# EAGLE design MicroPrimePCB (EAGLE 7.2.0)
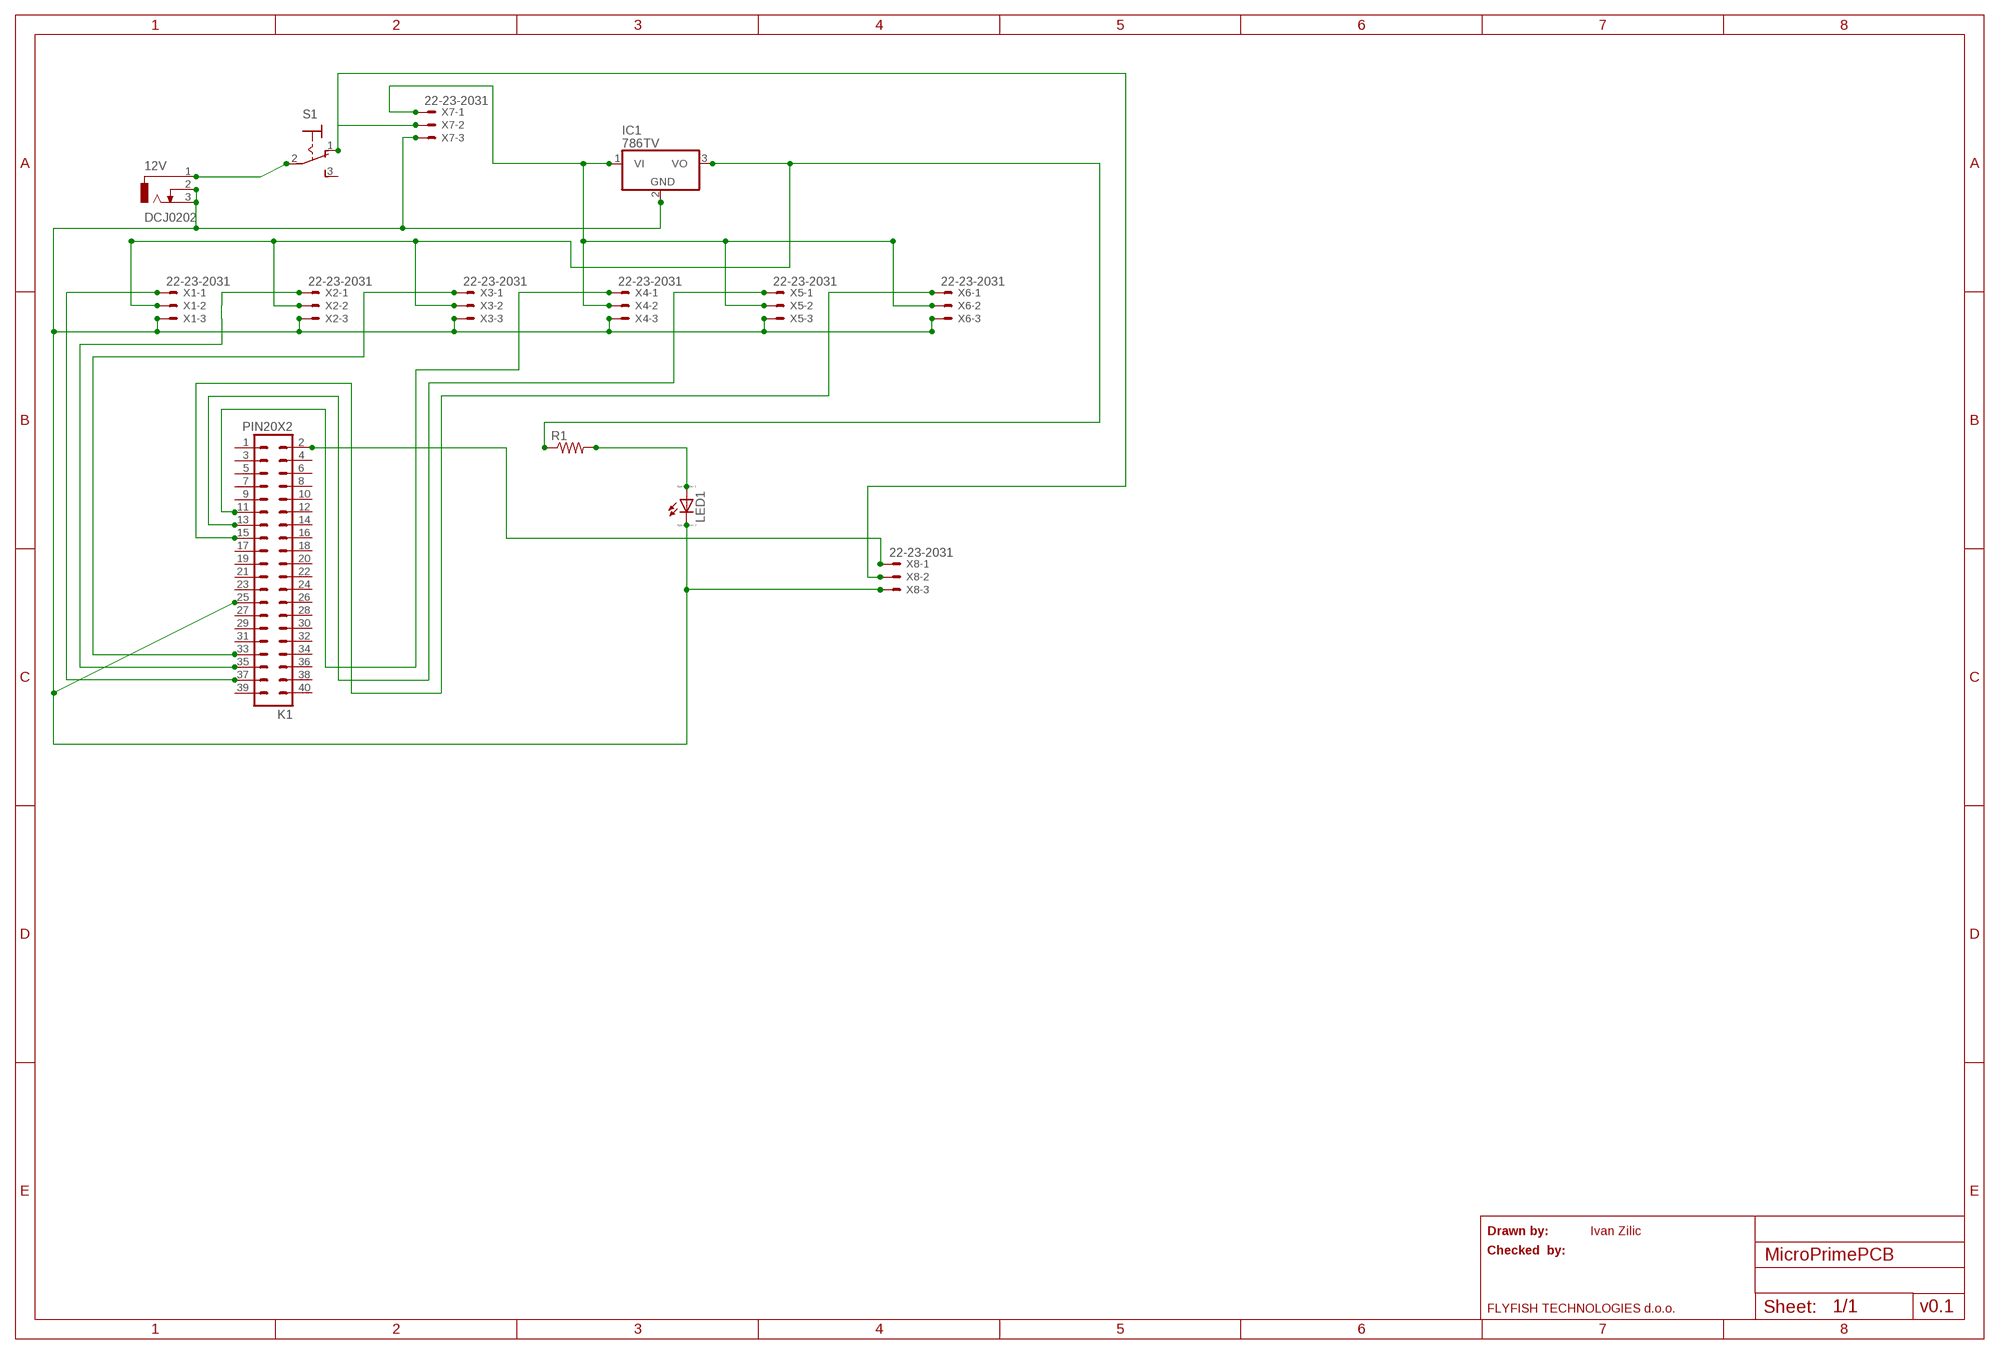
[diagram p0: schematic, sheet 1]

## Parts
12V  DCJ0202  [DCJ0202]
IC1  786TV  [TO220V]
K1  PIN20X2  [PIN_20X2]
LED1  LED_ELD260  [LED_LD260]
R1  R-US_0204/7  [0204/7]
S1  320-916  [320-916]
X1  22-23-2031  [22-23-2031]
X2  22-23-2031  [22-23-2031]
X3  22-23-2031  [22-23-2031]
X4  22-23-2031  [22-23-2031]
X5  22-23-2031  [22-23-2031]
X6  22-23-2031  [22-23-2031]
X7  22-23-2031  [22-23-2031]
X8  22-23-2031  [22-23-2031]

## Nets
N$1: 12V.1 S1.2(P)
N$4: IC1.1(VI) X4.2 X5.2 X6.2 X7.1
N$5: 12V.2 12V.3 IC1.2(GND) K1.25 LED1.K(C) X1.3 X2.3 X3.3 X4.3 X5.3 X6.3 X7.3 X8.3
N$6: K1.2 X8.1
N$7: S1.1(O) X7.2 X8.2
N$9: LED1.A R1.2
N$11: K1.37 X1.1
N$12: K1.35 X2.1
N$14: K1.33 X3.1
N$15: IC1.3(VO) R1.1 X1.2 X2.2 X3.2
N$16: K1.11 X4.1
N$18: K1.13 X5.1
N$20: K1.15 X6.1
Unconnected: K1.1 K1.3 K1.4 K1.5 K1.6 K1.7 K1.8 K1.9 K1.10 K1.12 K1.14 K1.16 K1.17 K1.18 K1.19 K1.20 K1.21 K1.22 K1.23 K1.24 K1.26 K1.27 K1.28 K1.29 K1.30 K1.31 K1.32 K1.34 K1.36 K1.38 K1.39 K1.40 S1.3(S)

## Notes on the sheet
- Drawn by: | Ivan Zilic
- Checked  by:
- FLYFISH TECHNOLOGIES d.o.o. | v0.1

## Library data of the parts
12V = con-jack:DCJ0202: DC POWER JACK Source: DCJ0202.pdf; OC_FARNELL: unknown; OC_NEWARK: unknown
IC1 = linear:78*: Positive VOLTAGE REGULATOR Source: http://cache.national.com/ds/LM/LM78L05.pdf http://www.fairchildsemi.com/ds/LM/LM7805.pdf
K1 = FLYFISH:PIN20X2
LED1 = eagle-ltspice:LED_E: LED Source: http://www.osram.convergy.de Source: www.luxeon.com Source: www.kingbright.com; SPICEMODEL: NONE; SPICEPREFIX: D; SPICETYPE: diode
R1 = resistor:R-US_: RESISTOR, American symbol
S1 = switch:320-916: TOGGLE SWITCH distributor RS Components
X1-X8 = con-molex:22-23-2031: .100" (2.54mm) Center Header - 3 Pin; MF: MOLEX; MPN: 22-23-2031; OC_FARNELL: 1462950; OC_NEWARK: 30C0862

## Net classes
0 default: clearance 0.205 mm

## Board
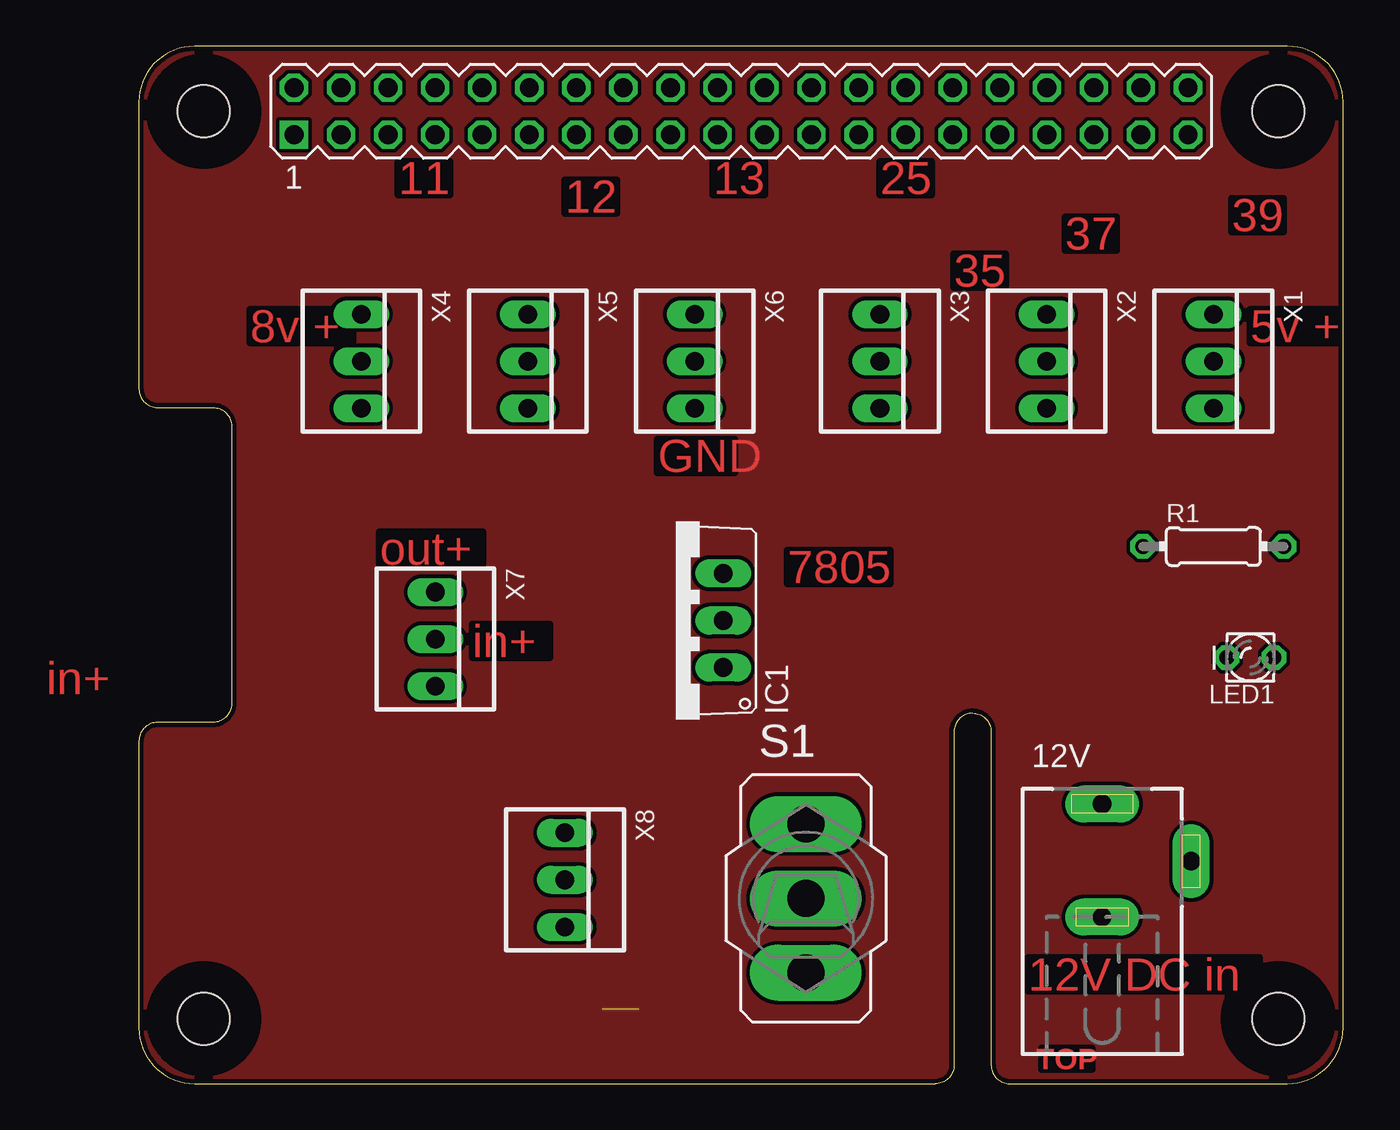
[diagram p1: board, top side]
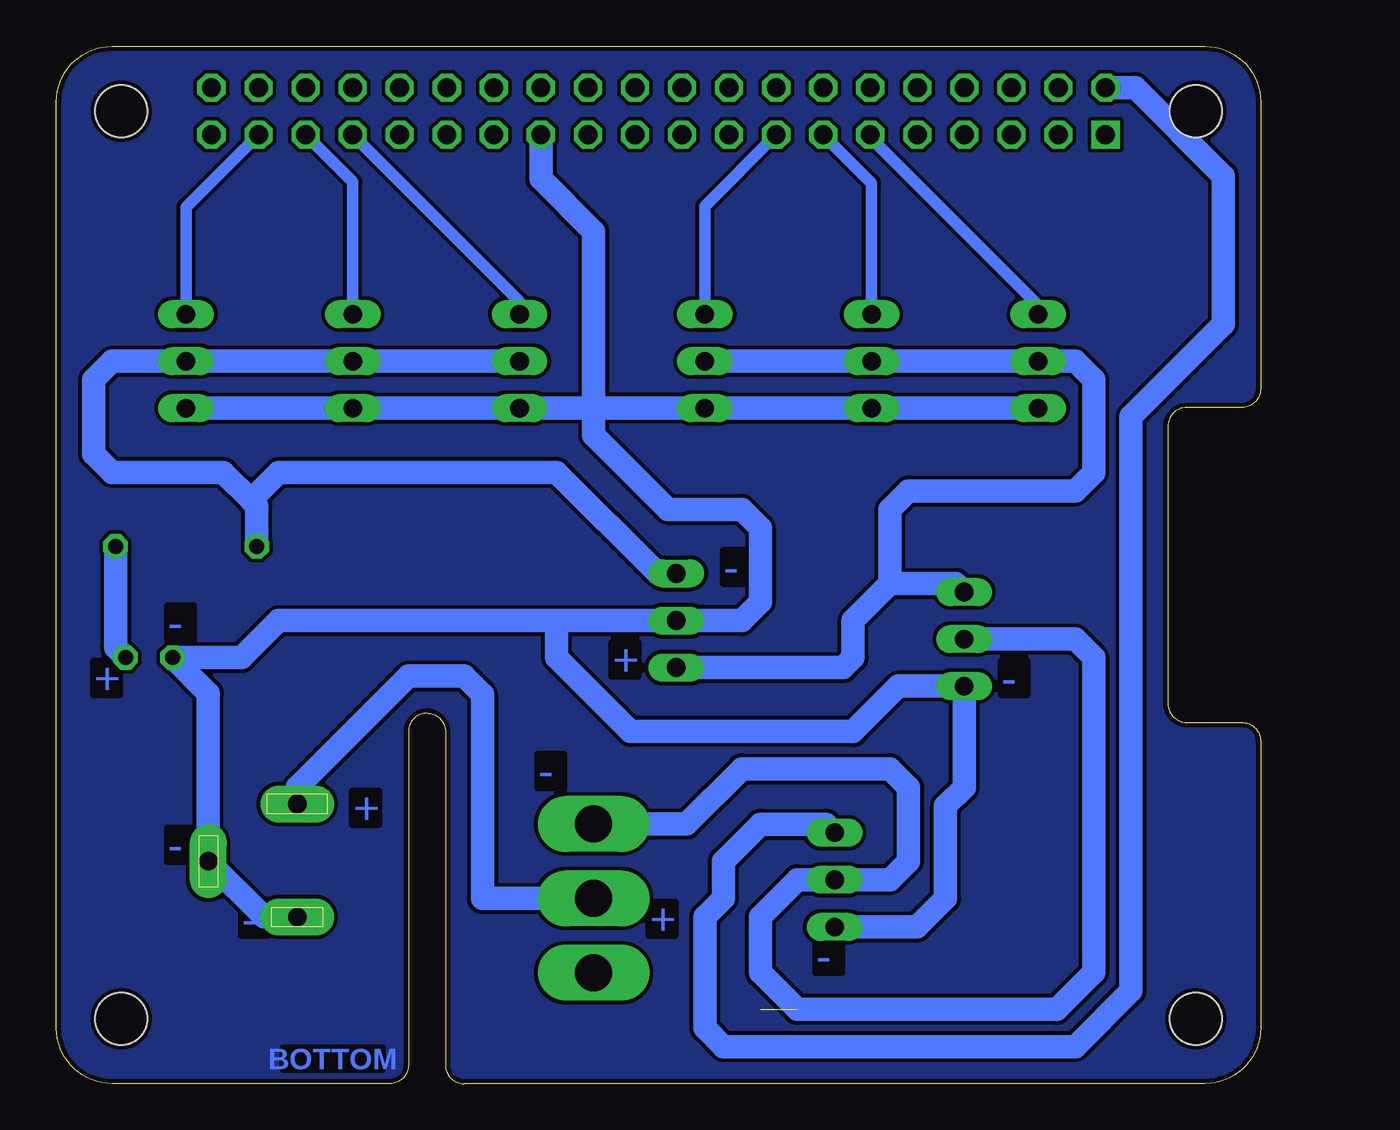
[diagram p2: board, bottom side, seen from below]

Size 65 x 56 mm. Coordinates in mm from the lower left corner, seen from the top.
Outline: 0,3 arc90 3,0 43,0 arc90 44,1 44,19 arc-90 45,20 arc-90 46,19 46,1 arc90 47,0 62,0 arc90 65,3 65,53 arc90 62,56 3,56 arc90 0,53 0,37.5 arc90 1,36.5 4,36.5 arc-90 5,35.5 5,20.5 arc-90 4,19.5 1,19.5 arc90 0,18.5 0,3
Copper layers (1*16): Top 0.035mm / dielectric 1.5mm / Bottom 0.035mm
Design rules "ITEADstudio_DRC": minimum track width 6mil, minimum drill 12mil, track to track 6mil, track to pad 6mil, pad to pad 6mil, via to via 6mil, smd to smd 0mil, copper to edge 10mil, drill to drill 10mil, minimum pad ring 10mil, minimum via ring 6mil, stop-mask expansion 2mil, vias tented up to drill 100mil, thermal gap 10mil
Holes 2.8 mm at 3.5,3.5 3.5,52.5 61.5,52.5 61.5,3.5
tRestrict: area 1.9,51 to 5,54; area 60,51 to 63,54; area 60,1.9 to 63,5; area 1.9,1.9 to 5,5

### Footprints (pad centres in the part's own frame; a part is rotated, then mirrored left to right if it is on the bottom)
DCJ0202 = drill 1 pad 2 long: 1 0,3.1; 2 4.8,0; 3 0,-3
TO220V = drill 1.016 long: 1 -2.54,-2.54; 2 0,-2.54; 3 2.54,-2.54
PIN_20X2 = drill 1.016 square: 1 -24.13,-1.27 | drill 1.016 octagon: 2 -24.13,1.27; 3 -21.59,-1.27; 4 -21.59,1.27; 5 -19.05,-1.27; 6 -19.05,1.27; 7 -16.51,-1.27; 8 -16.51,1.27; 9 -13.97,-1.27; 10 -13.97,1.27; 11 -11.43,-1.27; 12 -11.43,1.27; 13 -8.89,-1.27; 14 -8.89,1.27; 15 -6.35,-1.27; 16 -6.35,1.27; 17 -3.81,-1.27; 18 -3.81,1.27; 19 -1.27,-1.27; 20 -1.27,1.27; 21 1.27,-1.27; 22 1.27,1.27; 23 3.81,-1.27; 24 3.81,1.27; 25 6.35,-1.27; 26 6.35,1.27; 27 8.89,-1.27; 28 8.89,1.27; 29 11.43,-1.27; 30 11.43,1.27; 31 13.97,-1.27; 32 13.97,1.27; 33 16.51,-1.27; 34 16.51,1.27; 35 19.05,-1.27; 36 19.05,1.27; 37 21.59,-1.27; 38 21.59,1.27; 39 24.13,-1.27; 40 24.13,1.27
LED_LD260 = drill 0.813 octagon: A -1.27,0; K 1.27,0
0204/7 = drill 0.813 octagon: 1 -3.81,0; 2 3.81,0
320-916 = drill 2.007 long: 1 0,4.013; 2 0,0; 3 0,-4.013
22-23-2031 = drill 1 long: 1 -2.54,0; 2 0,0; 3 2.54,0

### Placement (x,y rotation side)
12V  52,12 0 top
DRILEGEND  [DRILEGEND]  11.87,-11.94 0 top  (outside the outline)
IC1  29,25 90 top
K1  32.5,52.5 0 top
LED1  60,23 180 top
R1  58,29 0 top
S1  36,10 0 top
X1  58,39 270 top
X2  49,39 270 top
X3  40,39 270 top
X4  12,39 270 top
X5  21,39 270 top
X6  30,39 270 top
X7  16,24 270 top
X8  23,11 270 top

### Tracks (layer width: path | path; a pad name or v marks a point on that pad's centre or on a via)
GND
  pour Bottom: 0,3 arc90 3,0 43,0 arc90 44,1 44,19 arc-90 45,20 arc-90 46,19 46,1 arc90 47,0 62,0 arc90 65,3 65,53 arc90 62,56 3,56 arc90 0,53 0,37.5 arc90 1,36.5 4,36.5 arc-90 5,35.5 5,20.5 arc-90 4,19.5 1,19.5 arc90 0,18.5
  pour Top: 0,3 arc90 3,0 43,0 arc90 44,1 44,19 arc-90 45,20 arc-90 46,19 46,1 arc90 47,0 62,0 arc90 65,3 65,53 arc90 62,56 3,56 arc90 0,53 0,37.5 arc90 1,36.5 4,36.5 arc-90 5,35.5 5,20.5 arc-90 4,19.5 1,19.5 arc90 0,18.5
N$1
  Bottom 1.27: 12V.1 52,16 46,22 43,22 42,21 42,10 S1.2
N$4
  Bottom 1.27: X6.2 X5.2 X4.2 10,39 9,38 9,33 10,32 19,32 20,31 20,27 | IC1.1 22.54,22.46 22,23 22,25 20,27 | 20,27 16.46,27 X7.1
N$5
  Bottom 1.27: 12V.3 53.8,9 12V.2 56.8,21.07 LED1.K 55,23 53,25 38,25 | X1.3 X2.3 X3.3 36,36.46 | X4.3 X5.3 X6.3 36,36.46 | K1.25 38.85,48.85 36,46 36,36.46 | 36,36.46 36,35 32,31 28,31 27,30 27,26 28,25 IC1.2 38,25 | X8.3 18.54,8.46 17,10 17,15 16,16 X7.3 19.54,21.46 22,19 34,19 38,23 38,25
N$6
  Bottom 1.27: X8.1 23.46,14 27,14 29,12 29,10 30,9 30,3 29,2 10,2 7,5 7,36 2,41 2,49 6.77,53.77 K1.2
N$7  (1 unrouted)
  Bottom 1.27: S1.1 30.99,14.01 28,17 20,17 19,16 19,12 20,11 X8.2 25,11 27,9 27,6 25,4 11,4 9,6 9,23 10,24 X7.2
N$9
  Bottom 1.27: R1.2 61.81,23.54 LED1.A
N$11
  Bottom 0.61: X1.1 58,47.32 K1.37
N$12
  Bottom 0.61: X2.1 49,48.68 K1.35
N$14
  Bottom 0.61: X3.1 40,42.22 K1.33
N$15
  Bottom 1.27: X3.2 X2.2 X1.2 62,39 63,38 63,34 62,33 56,33 54.5,31.5 | R1.1 54.19,31.19 54.5,31.5 | IC1.3 32.54,27.54 38,33 53,33 54.5,31.5
N$16
  Bottom 0.61: X4.1 12,42 21,51 21,51.16 K1.11
N$18
  Bottom 0.61: X5.1 21,48.62 K1.13
N$20
  Bottom 0.61: X6.1 30,47.38 K1.15

### Text on the board
Top: 11 | 13 | 25 | 12 | 39 | 37 | 35 | 8v + | 5v + | GND | out+ | 7805 | in+ | in+ | 12V DC in | TOP
Bottom: - | - | + | - | + | - | + | - | + | - | - | BOTTOM